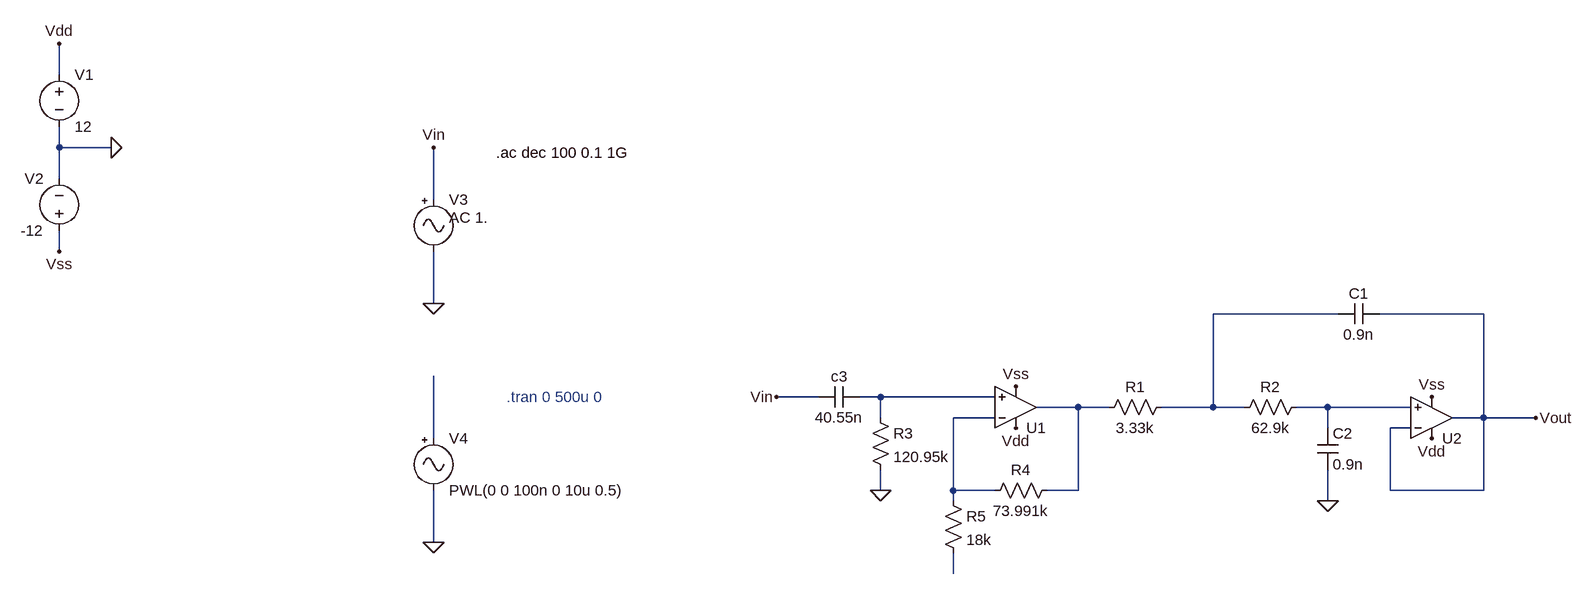
[diagram p0: schematic Ex2.asc]
Ex2.asc, the LTspice schematic file:
Version 4
SHEET 1 1108 1024
WIRE -1360 -384 -1360 -432
WIRE -1360 -272 -1360 -304
WIRE -1280 -272 -1360 -272
WIRE -1360 -224 -1360 -272
WIRE -784 -192 -784 -272
WIRE -1360 -112 -1360 -144
WIRE -784 -32 -784 -112
WIRE 608 -16 416 -16
WIRE 832 -16 672 -16
WIRE -192 112 -256 112
WIRE -96 112 -128 112
WIRE 80 112 -96 112
WIRE 208 128 144 128
WIRE 256 128 208 128
WIRE 416 128 416 -16
WIRE 416 128 336 128
WIRE 464 128 416 128
WIRE 592 128 544 128
WIRE 720 128 592 128
WIRE -96 144 -96 112
WIRE 80 144 16 144
WIRE 832 144 832 -16
WIRE 832 144 784 144
WIRE 912 144 832 144
WIRE 592 160 592 128
WIRE 720 160 688 160
WIRE -784 176 -784 80
WIRE -96 256 -96 224
WIRE 16 256 16 144
WIRE 80 256 16 256
WIRE 208 256 208 128
WIRE 208 256 160 256
WIRE 688 256 688 160
WIRE 832 256 832 144
WIRE 832 256 688 256
WIRE 16 272 16 256
WIRE 592 272 592 224
WIRE -784 336 -784 256
WIRE 16 384 16 352
FLAG -1280 -272 0
FLAG -1360 -112 Vss
FLAG -1360 -432 Vdd
FLAG 112 160 Vdd
FLAG 112 96 Vss
FLAG -96 256 0
FLAG 592 272 0
FLAG 752 176 Vdd
FLAG 752 112 Vss
FLAG 912 144 Vout
FLAG -256 112 Vin
FLAG -784 -32 0
FLAG -784 336 0
FLAG -784 -272 Vin
SYMBOL UniversalOpAmp2 112 128 M180
SYMATTR InstName U1
SYMBOL voltage -1360 -400 R0
SYMATTR InstName V1
SYMATTR Value 12
SYMBOL voltage -1360 -128 R180
WINDOW 0 24 96 Left 2
WINDOW 3 24 16 Left 2
SYMATTR InstName V2
SYMATTR Value -12
SYMBOL cap -128 96 R90
WINDOW 0 0 32 VBottom 2
WINDOW 3 32 32 VTop 2
SYMATTR InstName c3
SYMATTR Value 40.55n
SYMBOL res -112 128 R0
SYMATTR InstName R3
SYMATTR Value 120.95k
SYMBOL res 0 256 R0
SYMATTR InstName R5
SYMATTR Value 18k
SYMBOL res 176 240 R90
WINDOW 0 0 56 VBottom 2
WINDOW 3 32 56 VTop 2
SYMATTR InstName R4
SYMATTR Value 73.991k
SYMBOL res 352 112 R90
WINDOW 0 0 56 VBottom 2
WINDOW 3 32 56 VTop 2
SYMATTR InstName R1
SYMATTR Value 3.33k
SYMBOL res 560 112 R90
WINDOW 0 0 56 VBottom 2
WINDOW 3 32 56 VTop 2
SYMATTR InstName R2
SYMATTR Value 62.9k
SYMBOL cap 576 160 R0
SYMATTR InstName C2
SYMATTR Value 0.9n
SYMBOL UniversalOpAmp2 752 144 M180
SYMATTR InstName U2
SYMBOL cap 672 -32 R90
WINDOW 0 0 32 VBottom 2
WINDOW 3 32 32 VTop 2
SYMATTR InstName C1
SYMATTR Value 0.9n
SYMBOL signal -784 -208 R0
WINDOW 123 24 44 Left 2
WINDOW 39 0 0 Left 0
SYMATTR Value2 AC 1.
SYMATTR InstName V3
SYMATTR Value ""
SYMBOL signal -784 160 R0
WINDOW 123 24 132 Left 2
WINDOW 39 0 0 Left 0
SYMATTR InstName V4
SYMATTR Value PWL(0 0 100n 0 10u 0.5)
TEXT -688 -264 Left 2 !.ac dec 100 0.1 1G
TEXT -672 112 Left 2 ;.tran 0 500u 0

The netlist it stands for:
* Ex2.asc
XU1 N002 N005 Vdd Vss N003 level2 Avol=1Meg GBW=10Meg Slew=10Meg Ilimit=25m Rail=0 Vos=0 En=0 Enk=0 In=0 Ink=0 Rin=500Meg  ; pins In+ In- V+ V- OUT
V1 Vdd 0 12
V2 Vss 0 -12
c3 N002 Vin 40.55n
R3 N002 0 120.95k
R5 N005 N007 18k
R4 N003 N005 73.991k
R1 N001 N003 3.33k
R2 N004 N001 62.9k
C2 N004 0 0.9n
XU2 N004 Vout Vdd Vss Vout level2 Avol=1Meg GBW=10Meg Slew=10Meg Ilimit=25m Rail=0 Vos=0 En=0 Enk=0 In=0 Ink=0 Rin=500Meg  ; pins In+ In- V+ V- OUT
C1 Vout N001 0.9n
V3 Vin 0 AC 1.
V4 N006 0 PWL(0 0 100n 0 10u 0.5)
.ac dec 100 0.1 1G
* .tran 0 500u 0
.lib UniversalOpAmp2.lib
.backanno
.end